# Altium schematic sheet ES9023.SchDoc
size A4
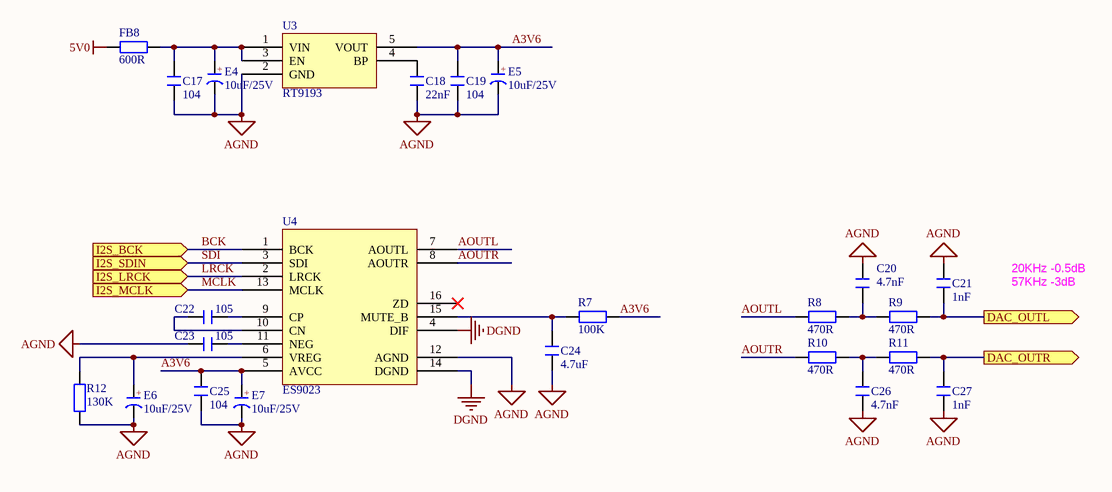
[diagram p0: ES9023.SchDoc]

## Parts
C17  104  [C 0603_L]
C18  22nF  [C 0603_L]
C19  104  [C 0603_L]
C20  4.7nF  [C 0603_L]
C21  1nF  [C 0603_L]
C22  105  [C 0603_L]
C23  105  [C 0603_L]
C24  4.7uF  [C 0603_L]
C25  104  [C 0603_L]
C26  4.7nF  [C 0603_L]
C27  1nF  [C 0603_L]
E4  10uF/25V  [CD A(3216)]
E5  10uF/25V  [CD A(3216)]
E6  10uF/25V  [CD A(3216)]
E7  10uF/25V  [CD A(3216)]
FB8  600R  [R 0805_L]
R7  100K  [R 0603_L]
R8  470R  [R 0603_L]
R9  470R  [R 0603_L]
R10  470R  [R 0603_L]
R11  470R  [R 0603_L]
R12  130K  [R 0603_L]
U3  RT9193  [SOT23-5N]
U4  ES9023  [SOP16_N]

## Ports
DAC_OUTL (out), DAC_OUTR (out), I2S_BCK (in), I2S_LRCK (in), I2S_MCLK (in), I2S_SDIN (in)

## Nets
5V0: FB8.1
AGND: C17.1 C18.1 C19.1 C20.2 C21.2 C23.2 C24.2 C25.1 C26.1 C27.1 E4.2(K) E5.2(K) E6.2(K) E7.2(K) R12.1 U3.2(GND) U4.12(AGND)
DGND: U4.4(DIF) U4.14(DGND)
A3V6: C19.2 C25.2 E5.1(A) E7.1(A) R7.1 U3.5(VOUT) U4.5(AVCC)
AOUTL: R8.2 U4.7(AOUTL)
AOUTR: R10.2 U4.8(AOUTR)
BCK: U4.1(BCK) ; port I2S_BCK
DAC_OUTL: C21.1 R9.1 ; port DAC_OUTL
DAC_OUTR: C27.2 R11.1 ; port DAC_OUTR
LRCK: U4.2(LRCK) ; port I2S_LRCK
MCLK: U4.13(MCLK) ; port I2S_MCLK
SDI: U4.3(SDI) ; port I2S_SDIN
NetC17_2: C17.2 E4.1(A) FB8.2 U3.1(VIN) U3.3(EN)
NetC18_2: C18.2 U3.4(BP)
NetC20_1: C20.1 R8.1 R9.2
NetC22_1: C22.1 U4.9(CP)
NetC22_2: C22.2 U4.10(CN)
NetC23_1: C23.1 U4.11(NEG)
NetC24_1: C24.1 R7.2 U4.15(MUTE_B)
NetC26_2: C26.2 R10.1 R11.2
NetE6_1: E6.1(A) R12.2 U4.6(VREG)

Not connected (* = marked no-connect by the designer): U4 16(ZD)*

## Notes on the sheet
- 20KHz -0.5dB
- 57KHz -3dB
- (in symbol CT) +

## Library data of the parts
C17-C27 = C: 贴片电容; BOM名称: 无极性贴片电容; 优秀评价可免费更新: 联系淘宝ID：黄晶宝石，获取更新版封装库; 卖家免费技术支持，联系售后: 唯一出售店铺网址https://shop463601444.taobao.com; 本封装库来自淘宝卖家 ID：黄晶宝石: 其他店铺购入均为盗版，请立即申请退款
E4-E7 = CT: 贴片钽电容; 优秀评价可免费更新: 联系淘宝ID：黄晶宝石，获取更新版封装库; 卖家免费技术支持，联系售后: 唯一出售店铺网址https://shop463601444.taobao.com; 本封装库来自淘宝卖家 ID：黄晶宝石: 其他店铺购入均为盗版，请立即申请退款; BOM名称: 贴片钽电容
FB8 R7-R12 = R: 贴片电阻; 优秀评价可免费更新: 联系淘宝ID：黄晶宝石，获取更新版封装库; 卖家免费技术支持，联系售后: 唯一出售店铺网址https://shop463601444.taobao.com; 本封装库来自淘宝卖家 ID：黄晶宝石: 其他店铺购入均为盗版，请立即申请退款; BOM名称: 贴片电阻
U3 = RT9193: 高PSRR低噪声高速稳压
U4 = ES9023: 24bit DAC 2Vrms